# Altium schematic sheet 04-Energy-Harvester.SchDoc: Solar energy harvester.
size 297 x 209 mm; Author: Dmitry Shpakov; Organization: NoName; Revision: Revision; PageSize: A4; ProjectName: Project Name
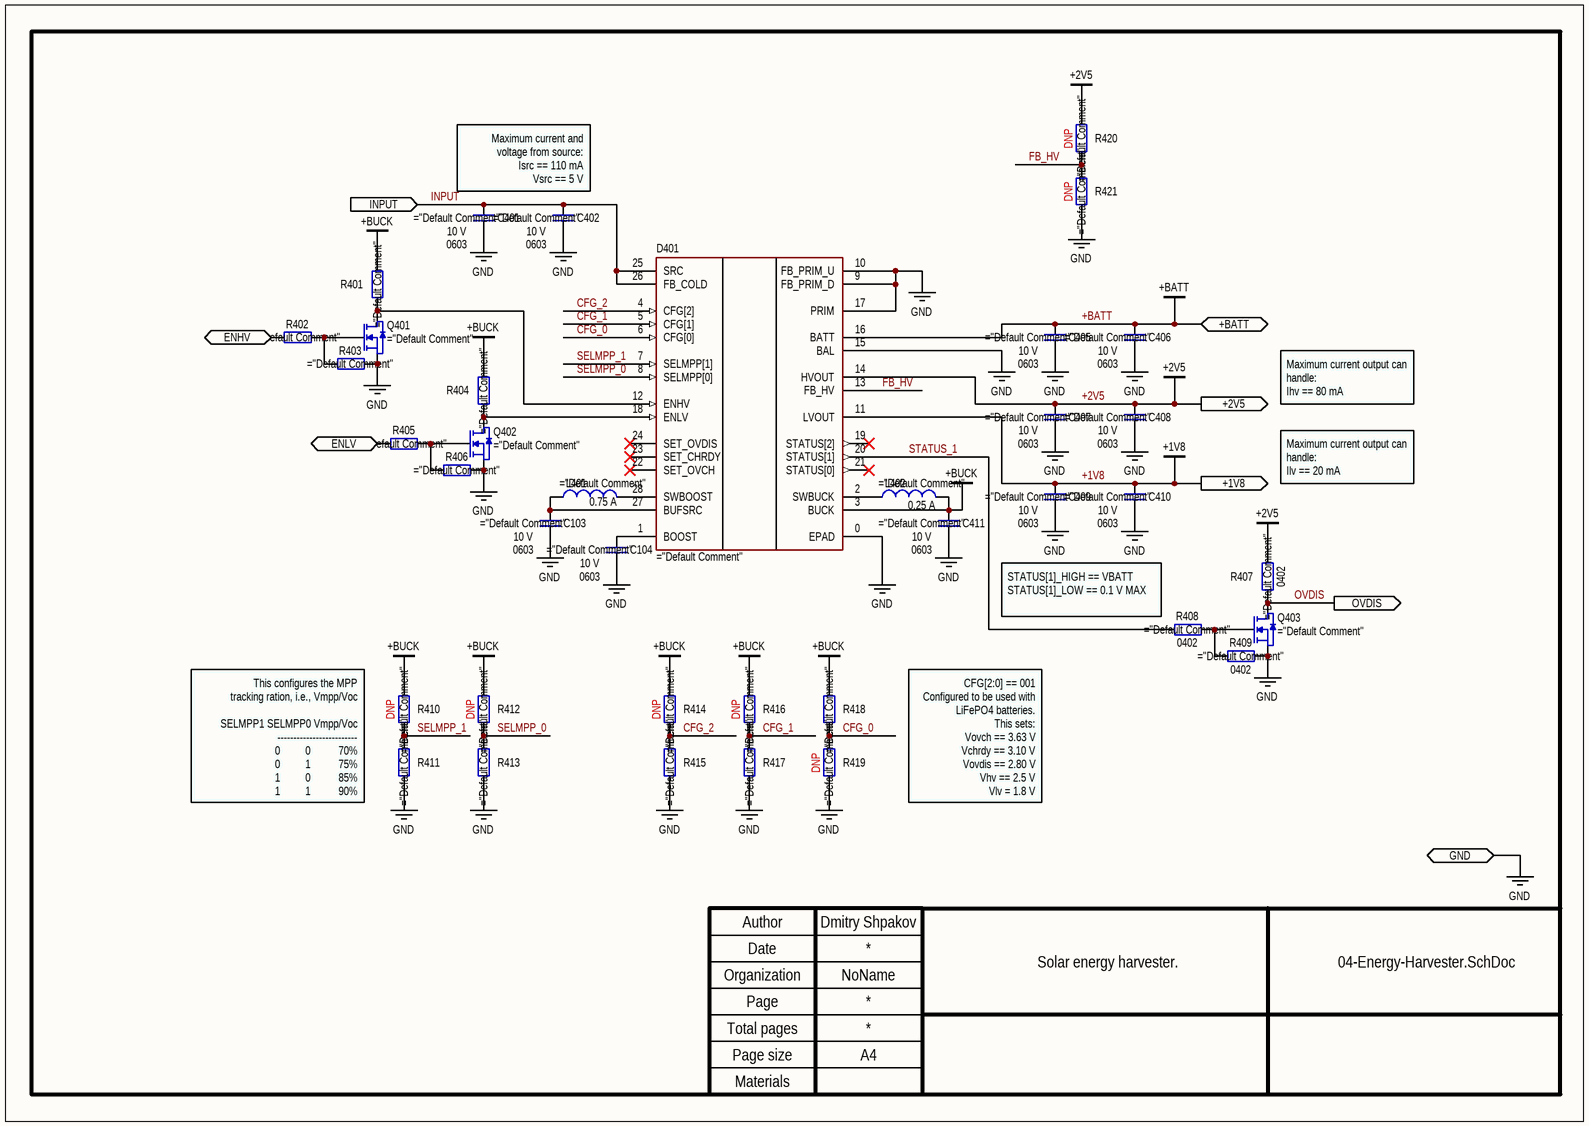
[diagram p0: 04-Energy-Harvester.SchDoc]

## Parts
C103  Rated Voltage: 10 V  Case: 0603  [CAP0603HD]
C104  Case: 0603  Rated Voltage: 10 V  [CAP0603HD]
C401  Case: 0603  Rated Voltage: 10 V  [CAP0603HD]
C402  Rated Voltage: 10 V  Case: 0603  [CAP0603HD]
C405  Case: 0603  Rated Voltage: 10 V  [CAP0603HD]
C406  Rated Voltage: 10 V  Case: 0603  [CAP0603HD]
C407  Case: 0603  Rated Voltage: 10 V  [CAP0603HD]
C408  Rated Voltage: 10 V  Case: 0603  [CAP0603HD]
C409  Case: 0603  Rated Voltage: 10 V  [CAP0603HD]
C410  Rated Voltage: 10 V  Case: 0603  [CAP0603HD]
C411  Rated Voltage: 10 V  Case: 0603  [CAP0603HD]
D401  (no value)  [AEM10941-QFN28]
L401  Rated Current: 0.75 A  [LPS4012-103MRC]
L402  Rated Current: 0.25 A  [MLZ1608M100WTD25]
Q401  (no value)  [DMG1012UW-7]
Q402  (no value)  [DMG1012UW-7]
Q403  (no value)  [DMG1012UW-7]
R401  (no value)  [0402]
R402  (no value)  [0402]
R403  (no value)  [0402]
R404  (no value)  [0402]
R405  (no value)  [0402]
R406  (no value)  [0402]
R407  (no value)  [0402]
R408  (no value)  [0402]
R409  (no value)  [0402]
R410  Assembly: DNP  [0402]
R411  (no value)  [0402]
R412  Assembly: DNP  [0402]
R413  (no value)  [0402]
R414  Assembly: DNP  [0402]
R415  (no value)  [0402]
R416  Assembly: DNP  [0402]
R417  (no value)  [0402]
R418  (no value)  [0402]
R419  Assembly: DNP  [0402]
R420  Assembly: DNP  [0402]
R421  Assembly: DNP  [0402]

## Ports
+1V8 (out), +2V5 (out), +BATT (bidir), ENHV (in), ENLV (in), GND (bidir), INPUT (in), OVDIS (out)

## Nets
+1V8: C409.2 C410.2 D401.11(LVOUT) ; port +1V8
+2V5: C407.2 C408.2 D401.14(HVOUT) R407.2 R420.2 ; port +2V5
+BATT: C405.2 C406.2 D401.16(BATT) ; port +BATT
+BUCK: C411.2 D401.3(BUCK) L402.2 R401.2 R404.2 R410.2 R412.2 R414.2 R416.2 R418.2
GND: C103.1 C104.1 C401.1 C402.1 C405.1 C406.1 C407.1 C408.1 C409.1 C410.1 C411.1 D401.0(EPAD) D401.9(FB_PRIM_D) D401.10(FB_PRIM_U) D401.15(BAL) D401.17(PRIM) Q401.S Q402.S Q403.S R403.2 R406.2 R409.2 R411.1 R413.1 R415.1 R417.1 R419.1 R421.1 ; port GND
CFG_0: D401.6(CFG[0]) R418.1 R419.2
CFG_1: D401.5(CFG[1]) R416.1 R417.2
CFG_2: D401.4(CFG[2]) R414.1 R415.2
ENHV: R402.1 ; port ENHV
ENLV: R405.1 ; port ENLV
FB_HV: D401.13(FB_HV) R420.1 R421.2
INPUT: C401.2 C402.2 D401.25(SRC) D401.26(FB_COLD) ; port INPUT
OVDIS: Q403.D R407.1 ; port OVDIS
SELMPP_0: D401.8(SELMPP[0]) R412.1 R413.2
SELMPP_1: D401.7(SELMPP[1]) R410.1 R411.2
STATUS_1: D401.20(STATUS[1]) R408.1
NetC103_2: C103.2 D401.27(BUFSRC) L401.1
NetC104_2: C104.2 D401.1(BOOST)
NetD401_2: D401.2(SWBUCK) L402.1
NetD401_12: D401.12(ENHV) Q401.D R401.1
NetD401_18: D401.18(ENLV) Q402.D R404.1
NetD401_28: D401.28(SWBOOST) L401.2
NetQ401_G: Q401.G R402.2 R403.1
NetQ402_G: Q402.G R405.2 R406.1
NetQ403_G: Q403.G R408.2 R409.1

Not connected (* = marked no-connect by the designer): D401 19(STATUS[2])* 21(STATUS[0])* 22(SET_OVCH)* 23(SET_CHRDY)* 24(SET_OVDIS)*

## Notes on the sheet
- Maximum current and voltage from source:
  Isrc == 110 mA
  Vsrc == 5 V
- Maximum current output can handle:
  Ihv == 80 mA
- Maximum current output can handle:
  Ilv == 20 mA
- (near R408) STATUS[1]_HIGH == VBATT
  STATUS[1]_LOW == 0.1 V MAX
- This configures the MPP
  tracking ration, i.e., Vmpp/Voc
  SELMPP1 SELMPP0 Vmpp/Voc
  -------------------------
  0         0          70%
  0         1          75%
  1         0          85%
  1         1          90%
- CFG[2:0] == 001
  Configured to be used with
  LiFePO4 batteries.
  This sets:
  Vovch == 3.63 V
  Vchrdy == 3.10 V
  Vovdis == 2.80 V
  Vhv == 2.5 V
  Vlv = 1.8 V
- Author
- Date
- Organization
- Page
- Total pages
- Materials
- Page size

## Library data of the parts
C103 C402 C406 C408 C410 C411 = GRM188R61A106ME69D: CAP CER 10UF 10V X5R 0603; Manufacturer: Murata Electronics; Type: capacitor; Power Dissipation: * W; Rated Current: * A; Tolerance: 20 %; Other: 10 µF ±20% 10V Ceramic Capacitor X5R 0603 (1608 Metric); Operating Temperature: -55 °C to +85 °C; HelpURL: https://www.digikey.com/en/products/detail/murata-electronics/GRM188R61A106ME69D/5027560; Default Comment: 10 uF; Rated Power: * W; Value: 10 uF; Summary: ="Type"+" "+"Part Number"+" "+"Manufacturer"+" "+"Value"+" "+"Tolerance"+" "+"Operating Temperature"+" "+"Case"+" "+"Power Dissipation"+" "+"Rated Current"+" "+"Rated Power"+" "+"Rated Voltage"+" "+"Other"; Part Number: GRM188R61A106ME69D; Assembly: *
C104 C401 C405 C407 C409 = GRM188R61A226ME15J: CAP CER 22UF 10V X5R 0603; Manufacturer: Murata Electronics; Type: capacitor; Power Dissipation: * W; Rated Current: * A; Tolerance: 20 %; Other: 22 µF ±20% 10V Ceramic Capacitor X5R 0603 (1608 Metric); Operating Temperature: -55 °C to +85 °C; HelpURL: https://www.digikey.com/en/products/detail/murata-electronics/GRM188R61A226ME15J/6605932; Default Comment: 22 uF; Rated Power: * W; Value: 22 uF; Summary: ="Type"+" "+"Part Number"+" "+"Manufacturer"+" "+"Value"+" "+"Tolerance"+" "+"Operating Temperature"+" "+"Case"+" "+"Power Dissipation"+" "+"Rated Current"+" "+"Rated Power"+" "+"Rated Voltage"+" "+"Other"; Part Number: GRM188R61A226ME15J; Assembly: *
D401 = AEM10941: Power Management Specialised - PMIC AEM10941 IC - Photovoltaic Energy Harvesting Manager; Manufacturer: e-peas; Default Comment: AEM10941-QFN; Power Dissipation: * W; Rated Voltage: 1.2 to 4.5 V; Rated Current: Input: 110 mA, Output: 20 mA 80 mA; Tolerance: * %; Case: QFN-28; Operating Temperature: -40 °C to +125 °C; Type: IC; HelpURL: https://eu.mouser.com/ProductDetail/e-peas/AEM10941-QFN?qs=W%2FMpXkg%252BdQ7CeqB2lBPbRQ%3D%3D; Rated Power: * W; Value: *; Other: Power Management Specialised - PMIC AEM10941 IC - Photovoltaic Energy Harvesting Manager; Summary: ="Type"+" "+"Part Number"+" "+"Manufacturer"+" "+"Value"+" "+"Tolerance"+" "+"Operating Temperature"+" "+"Case"+" "+"Power Dissipation"+" "+"Rated Current"+" "+"Rated Power"+" "+"Rated Voltage"+" "+"Other"; Part Number: AEM10941-QFN; Assembly: *
L401 = LPS4012-103MRC: Fixed Inductors 10uH Shld 20% 1.1A 350 mOhms; Manufacturer: Coilcraft; Power Dissipation: * W; Rated Voltage: * V; Other: Fixed inductor, 10 uH, Isat=1.1A, Imax=0.75A, Rmax=0.35Ohm Fsr=40MHz,; Case: 1515 (4040 metric); Operating Temperature: -40 °C to +85 °C; Type: inductor; HelpURL: https://eu.mouser.com/ProductDetail/Coilcraft/LPS4012-103MRC?qs=QQJxVsr8EGanxcNaj8pdMQ%3D%3D; Default Comment: 10 uH; Rated Power: * W; Tolerance: 20 %; Value: 10 uH; Summary: ="Type"+" "+"Part Number"+" "+"Manufacturer"+" "+"Value"+" "+"Tolerance"+" "+"Operating Temperature"+" "+"Case"+" "+"Power Dissipation"+" "+"Rated Current"+" "+"Rated Power"+" "+"Rated Voltage"+" "+"Other"; Part Number: LPS4012-103MRC; Assembly: *
L402 = MLZ1608M100WTD25: FIXED IND 10UH 250MA 1.05OHM SMD; Manufacturer: TDK Corporation; Type: inductor; Power Dissipation: * W; Rated Voltage: * V; Tolerance: 20 %; Other: 10 µH Shielded Multilayer Inductor 250 mA 1.05Ohm 0603 (1608 Metric); Case: 0603; Operating Temperature: -55 °C to +125 °C; HelpURL: https://www.digikey.com/en/products/detail/tdk-corporation/MLZ1608M100WTD25/4743176; Default Comment: 10 uH; Rated Power: * W; Value: 10 uH; Summary: ="Type"+" "+"Part Number"+" "+"Manufacturer"+" "+"Value"+" "+"Tolerance"+" "+"Operating Temperature"+" "+"Case"+" "+"Power Dissipation"+" "+"Rated Current"+" "+"Rated Power"+" "+"Rated Voltage"+" "+"Other"; Part Number: MLZ1608M100WTD25; Assembly: *
Q401-Q403 = DMG1012UW-7: MOSFET N-CH 20V 1A SOT323; Manufacturer: Diodes Incorporated; Power Dissipation: 290 mW; Tolerance: * %; Value: N-channel; Other: N-Channel 20 V 1A (Ta) 290mW (Ta) Surface Mount SOT-323; Case: SOT-323; Operating Temperature: -55 °C to +150 °C; Type: MOSFET; HelpURL: https://www.digikey.com/en/products/detail/diodes-incorporated/DMG1012UW-7/2183239?s=N4IgTCBcDaICIFkDiBGADCsBVA6gWgHYQBdAXyA; Default Comment: DMG1012UW-7; Rated Voltage: 20 V; Rated Current: 1 A; Rated Power: 290 mW; Summary: ="Type"+" "+"Part Number"+" "+"Manufacturer"+" "+"Value"+" "+"Tolerance"+" "+"Operating Temperature"+" "+"Case"+" "+"Power Dissipation"+" "+"Rated Current"+" "+"Rated Power"+" "+"Rated Voltage"+" "+"Other"; Part Number: DMG1012UW-7; Assembly: *
R401 R403 R404 R406 R407 R409 = RC0402JR-0710KL: RES 10K OHM 5% 1/16W 0402; Manufacturer: YAGEO; Rated Voltage: * V; Rated Current: * A; Other: 10 kOhms ±5% 0.063W, 1/16W Chip Resistor 0402 (1005 Metric) Moisture Resistant Thick Film; Operating Temperature: -55 °C to +155 °C; Type: resistor; HelpURL: https://www.digikey.com/en/products/detail/yageo/RC0402JR-0710KL/726418; Default Comment: 10k; Power Dissipation: 1/16 W; Rated Power: 1/16 W; Tolerance: 5 %; Value: 10k; Summary: ="Type"+" "+"Part Number"+" "+"Manufacturer"+" "+"Value"+" "+"Tolerance"+" "+"Operating Temperature"+" "+"Case"+" "+"Power Dissipation"+" "+"Rated Current"+" "+"Rated Power"+" "+"Rated Voltage"+" "+"Other"; Part Number: RC0402JR-0710KL; Assembly: *; Case: 0402
R402 R405 R408 = RC0402FR-07100RL: RES 100 OHM 1% 1/16W 0402; Manufacturer: YAGEO; Default Comment: 100R; Rated Voltage: * V; Rated Current: * A; Value: 100R; Other: 100 Ohms ±1% 0.063W, 1/16W Chip Resistor 0402 (1005 Metric) Moisture Resistant Thick Film; Operating Temperature: -55 °C to +155 °C; Type: resistor; HelpURL: https://www.digikey.com/en/products/detail/yageo/RC0402FR-07100RL/726527; Power Dissipation: 1/16 W; Rated Power: 1/16 W; Tolerance: 1 %; Summary: ="Type"+" "+"Part Number"+" "+"Manufacturer"+" "+"Value"+" "+"Tolerance"+" "+"Operating Temperature"+" "+"Case"+" "+"Power Dissipation"+" "+"Rated Current"+" "+"Rated Power"+" "+"Rated Voltage"+" "+"Other"; Part Number: RC0402FR-07100RL; Assembly: *; Case: 0402
R410-R421 = RC0402FR-070RL: RES 0 OHM JUMPER 1/16W 0402; Manufacturer: YAGEO; Default Comment: 0R; Rated Voltage: * V; Rated Current: * A; Value: 0R; Other: 0 Ohms Jumper 0.063W, 1/16W Chip Resistor 0402 (1005 Metric) Moisture Resistant Thick Film; Operating Temperature: -55 °C to +155 °C; Type: resistor; HelpURL: https://www.digikey.com/en/products/detail/yageo/RC0402FR-070RL/2827570; Power Dissipation: 1/16 W; Rated Power: 1/16 W; Tolerance: jumper; Summary: ="Type"+" "+"Part Number"+" "+"Manufacturer"+" "+"Value"+" "+"Tolerance"+" "+"Operating Temperature"+" "+"Case"+" "+"Power Dissipation"+" "+"Rated Current"+" "+"Rated Power"+" "+"Rated Voltage"+" "+"Other"; Part Number: RC0402FR-070RL; Case: 0402
  R411 R413 R415 R417 R418: Assembly: *